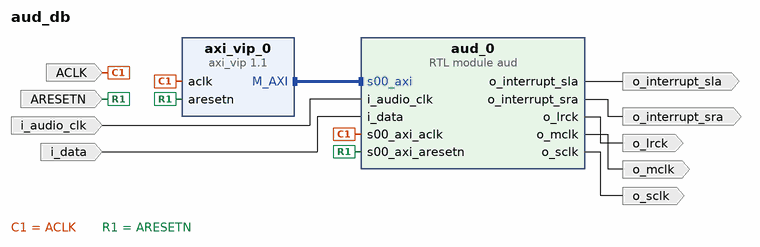
[diagram p0: block diagram of the top level]
# Vivado block design aud_db, xc7a100tcsg324-1, Vivado 2023.2
create_bd_design aud_db

create_bd_port -dir O o_mclk
create_bd_port -dir O o_lrck
create_bd_port -dir O o_sclk
create_bd_port -dir I -type rst ARESETN
create_bd_port -dir I i_data
create_bd_port -dir I -type clk ACLK
set_property -dict {CONFIG.FREQ_HZ 100000000} [get_bd_ports ACLK]
create_bd_port -dir O o_interrupt_sla
create_bd_port -dir O o_interrupt_sra
create_bd_port -dir I -type clk i_audio_clk
set_property -dict {CONFIG.FREQ_HZ 24576000} [get_bd_ports i_audio_clk]

create_bd_cell -type module -reference aud aud_0
create_bd_cell -type ip -vlnv xilinx.com:ip:axi_vip:1.1 axi_vip_0
set_property -dict [list \
  CONFIG.ADDR_WIDTH 32 \
  CONFIG.DATA_WIDTH 32 \
  CONFIG.HAS_BRESP 1 \
  CONFIG.HAS_PROT 1 \
  CONFIG.HAS_RRESP 1 \
  CONFIG.HAS_WSTRB 1 \
  CONFIG.INTERFACE_MODE MASTER \
  CONFIG.PROTOCOL AXI4LITE \
  CONFIG.READ_WRITE_MODE READ_WRITE \
] [get_bd_cells axi_vip_0]

# ---- connections ----

connect_bd_intf_net [get_bd_intf_pins axi_vip_0/M_AXI] [get_bd_intf_pins aud_0/s00_axi]
connect_bd_net [get_bd_ports ACLK] [get_bd_pins axi_vip_0/aclk] [get_bd_pins aud_0/s00_axi_aclk]
connect_bd_net [get_bd_ports ARESETN] [get_bd_pins axi_vip_0/aresetn] [get_bd_pins aud_0/s00_axi_aresetn]
connect_bd_net [get_bd_pins aud_0/o_interrupt_sla] [get_bd_ports o_interrupt_sla]
connect_bd_net [get_bd_pins aud_0/o_interrupt_sra] [get_bd_ports o_interrupt_sra]
connect_bd_net [get_bd_pins aud_0/o_lrck] [get_bd_ports o_lrck]
connect_bd_net [get_bd_pins aud_0/o_mclk] [get_bd_ports o_mclk]
connect_bd_net [get_bd_pins aud_0/o_sclk] [get_bd_ports o_sclk]
connect_bd_net -net i_audio_clk_0_1 [get_bd_ports i_audio_clk] [get_bd_pins aud_0/i_audio_clk]
connect_bd_net [get_bd_ports i_data] [get_bd_pins aud_0/i_data]

# ---- address map ----
assign_bd_address -offset 0x00000000 -range 4K -target_address_space [get_bd_addr_spaces axi_vip_0/Master_AXI] [get_bd_addr_segs aud_0/s00_axi/reg0]

validate_bd_design
save_bd_design
